# Altium schematic sheet Ana_4V096.SchDoc
size A4
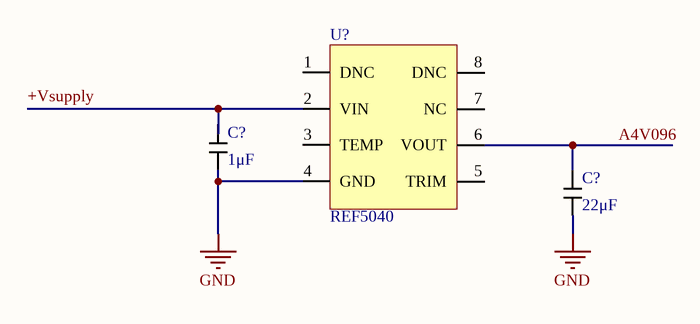
[diagram p0: Ana_4V096.SchDoc]

## Parts
(Parts that share a designator on the sheet are numbered #1, #2 ... from top to bottom, then left to right.)
C?#1  1μF  [0603]
C?#2  22μF  [0603]
U?  REF5040

## Nets
GND: U?.4(GND)
A4V096: U?.6(VOUT)

Not connected (* = marked no-connect by the designer): U? 1(DNC) 2(VIN) 3(TEMP) 5(TRIM) 7(NC) 8(DNC)

## Notes on the sheet
- Labels drawn without touching a wire or pin: +Vsupply

## Library data of the parts
C?#1 C?#2 = Cap 0603